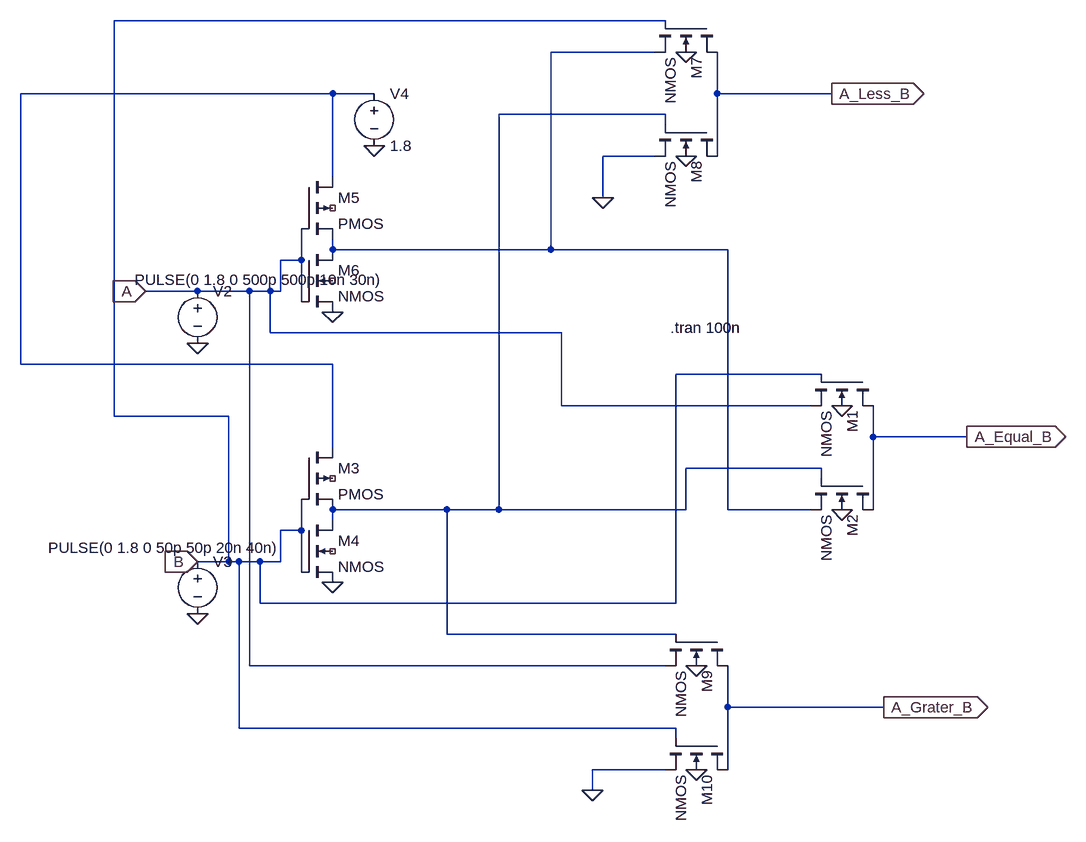
[diagram p0: schematic PASS_Comparator.asc]
PASS_Comparator.asc, the LTspice schematic file:
Version 4
SHEET 1 880 724
WIRE 240 -496 -608 -496
WIRE 224 -448 64 -448
WIRE -272 -384 -752 -384
WIRE -208 -384 -272 -384
WIRE 320 -384 320 -448
WIRE 496 -384 320 -384
WIRE 240 -352 -16 -352
WIRE 240 -336 240 -352
WIRE 224 -288 144 -288
WIRE 320 -288 320 -384
WIRE -272 -256 -272 -384
WIRE 144 -224 144 -288
WIRE -272 -144 -272 -160
WIRE 64 -144 64 -448
WIRE 64 -144 -272 -144
WIRE 336 -144 64 -144
WIRE -320 -128 -320 -176
WIRE -320 -128 -352 -128
WIRE -480 -80 -560 -80
WIRE -400 -80 -480 -80
WIRE -368 -80 -400 -80
WIRE -352 -80 -352 -128
WIRE -352 -80 -368 -80
WIRE -320 -64 -320 -128
WIRE -368 -16 -368 -80
WIRE 80 -16 -368 -16
WIRE -752 32 -752 -384
WIRE -272 32 -752 32
WIRE 480 48 256 48
WIRE 80 96 80 -16
WIRE 464 96 80 96
WIRE -608 112 -608 -496
WIRE -432 112 -608 112
WIRE 560 144 560 96
WIRE 704 144 560 144
WIRE -272 160 -272 32
WIRE 480 192 272 192
WIRE 480 208 480 192
WIRE -96 256 -272 256
WIRE -16 256 -16 -352
WIRE -16 256 -96 256
WIRE 272 256 272 192
WIRE 272 256 -16 256
WIRE 336 256 336 -144
WIRE 464 256 336 256
WIRE 560 256 560 144
WIRE -272 272 -272 256
WIRE -320 288 -320 240
WIRE -320 288 -352 288
WIRE -432 336 -432 112
WIRE -432 336 -480 336
WIRE -416 336 -432 336
WIRE -384 336 -416 336
WIRE -352 336 -352 288
WIRE -352 336 -384 336
WIRE -320 352 -320 288
WIRE -384 400 -384 336
WIRE 256 400 256 48
WIRE 256 400 -384 400
WIRE -96 448 -96 256
WIRE 256 448 -96 448
WIRE -400 496 -400 -80
WIRE 240 496 -400 496
WIRE 336 560 336 496
WIRE 576 560 336 560
WIRE -416 592 -416 336
WIRE 256 592 -416 592
WIRE 256 608 256 592
WIRE 240 656 128 656
WIRE 336 656 336 560
WIRE 128 688 128 656
FLAG -480 0 0
FLAG -480 416 0
FLAG 704 144 A_Equal_B
IOPIN 704 144 Out
FLAG -560 -80 A
IOPIN -560 -80 In
FLAG -480 336 B
IOPIN -480 336 In
FLAG -272 368 0
FLAG -208 -304 0
FLAG -272 -48 0
FLAG 144 -224 0
FLAG 128 688 0
FLAG 496 -384 A_Less_B
IOPIN 496 -384 Out
FLAG 576 560 A_Grater_B
IOPIN 576 560 Out
FLAG 272 -448 0
FLAG 272 -288 0
FLAG 512 96 0
FLAG 512 256 0
FLAG 288 496 0
FLAG 288 656 0
SYMBOL nmos4 560 48 R90
SYMATTR InstName M1
SYMBOL nmos4 560 208 R90
SYMATTR InstName M2
SYMBOL pmos4 -320 160 R0
SYMATTR InstName M3
SYMBOL nmos4 -320 272 R0
SYMATTR InstName M4
SYMBOL voltage -480 -96 R0
WINDOW 3 -97 -2 Left 2
WINDOW 123 0 0 Left 0
WINDOW 39 0 0 Left 0
SYMATTR Value PULSE(0 1.8 0 500p 500p 10n 30n)
SYMATTR InstName V2
SYMBOL voltage -480 320 R0
WINDOW 3 -230 -5 Left 2
WINDOW 123 0 0 Left 0
WINDOW 39 0 0 Left 0
SYMATTR Value PULSE(0 1.8 0 50p 50p 20n 40n)
SYMATTR InstName V3
SYMBOL pmos4 -320 -256 R0
SYMATTR InstName M5
SYMBOL nmos4 -320 -144 R0
SYMATTR InstName M6
SYMBOL voltage -208 -400 R0
WINDOW 123 0 0 Left 0
WINDOW 39 0 0 Left 0
SYMATTR InstName V4
SYMATTR Value 1.8
SYMBOL nmos4 320 -496 R90
SYMATTR InstName M7
SYMBOL nmos4 320 -336 R90
SYMATTR InstName M8
SYMBOL nmos4 336 448 R90
SYMATTR InstName M9
SYMBOL nmos4 336 608 R90
SYMATTR InstName M10
TEXT 248 -24 Left 2 !.tran 100n

The netlist it stands for:
* PASS_Comparator.asc
M1 A_Equal_B B A 0 NMOS
M2 A_Equal_B N003 N001 0 NMOS
M3 N002 B N003 NC_01 PMOS
M4 N003 B 0 NC_02 NMOS
V2 A 0 PULSE(0 1.8 0 500p 500p 10n 30n)
V3 B 0 PULSE(0 1.8 0 50p 50p 20n 40n)
M5 N002 A N001 NC_03 PMOS
M6 N001 A 0 NC_04 NMOS
V4 N002 0 1.8
M7 A_Less_B B N001 0 NMOS
M8 A_Less_B N003 0 0 NMOS
M9 A_Grater_B N003 A 0 NMOS
M10 A_Grater_B B 0 0 NMOS
.model NMOS NMOS
.model PMOS PMOS
.lib standard.mos
.tran 100n
.backanno
.end